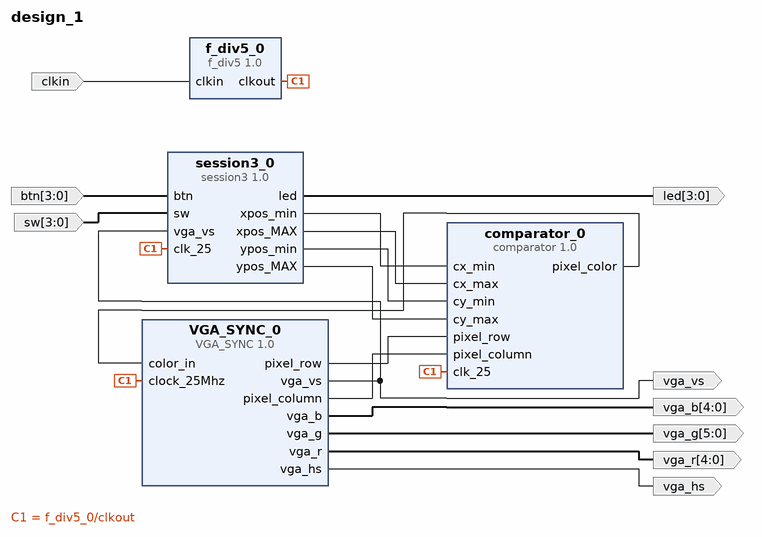
[diagram p0: block diagram of the top level]
# Vivado block design design_1, Vivado 2014.3.1
create_bd_design design_1

create_bd_port -dir O vga_vs
create_bd_port -dir O -from 3 -to 0 led
create_bd_port -dir I -from 3 -to 0 btn
create_bd_port -dir I -from 3 -to 0 sw
create_bd_port -dir I clkin
create_bd_port -dir O -from 4 -to 0 vga_r
create_bd_port -dir O -from 4 -to 0 vga_b
create_bd_port -dir O -from 5 -to 0 vga_g
create_bd_port -dir O vga_hs

create_bd_cell -type ip -vlnv xilinx.com:ip:comparator:1.0 comparator_0
create_bd_cell -type ip -vlnv xilinx.com:ip:session3:1.0 session3_0
create_bd_cell -type ip -vlnv xilinx.com:ip:f_div5:1.0 f_div5_0
create_bd_cell -type ip -vlnv xilinx.com:ip:VGA_SYNC:1.0 VGA_SYNC_0

# ---- connections ----

connect_bd_net [get_bd_pins VGA_SYNC_0/vga_vs] [get_bd_ports vga_vs] [get_bd_pins session3_0/vga_vs]
connect_bd_net [get_bd_pins f_div5_0/clkout] [get_bd_pins comparator_0/clk_25] [get_bd_pins session3_0/clk_25] [get_bd_pins VGA_SYNC_0/clock_25Mhz]
connect_bd_net [get_bd_pins session3_0/led] [get_bd_ports led]
connect_bd_net [get_bd_pins session3_0/xpos_min] [get_bd_pins comparator_0/cx_min]
connect_bd_net [get_bd_pins session3_0/xpos_MAX] [get_bd_pins comparator_0/cx_max]
connect_bd_net [get_bd_pins session3_0/ypos_min] [get_bd_pins comparator_0/cy_min]
connect_bd_net [get_bd_pins session3_0/ypos_MAX] [get_bd_pins comparator_0/cy_max]
connect_bd_net [get_bd_ports btn] [get_bd_pins session3_0/btn]
connect_bd_net [get_bd_ports sw] [get_bd_pins session3_0/sw]
connect_bd_net [get_bd_ports clkin] [get_bd_pins f_div5_0/clkin]
connect_bd_net [get_bd_pins VGA_SYNC_0/vga_r] [get_bd_ports vga_r]
connect_bd_net [get_bd_pins VGA_SYNC_0/vga_b] [get_bd_ports vga_b]
connect_bd_net [get_bd_pins VGA_SYNC_0/vga_g] [get_bd_ports vga_g]
connect_bd_net [get_bd_pins VGA_SYNC_0/vga_hs] [get_bd_ports vga_hs]
connect_bd_net [get_bd_pins VGA_SYNC_0/pixel_row] [get_bd_pins comparator_0/pixel_row]
connect_bd_net [get_bd_pins VGA_SYNC_0/pixel_column] [get_bd_pins comparator_0/pixel_column]
connect_bd_net [get_bd_pins comparator_0/pixel_color] [get_bd_pins VGA_SYNC_0/color_in]

validate_bd_design
save_bd_design
